# Altium schematic sheet 780-00055, rev1, Pg3, SCH, NRES Temp Meas, 8-Chan RTD .SchDoc
size B; PageSetup: Record=PageOptions|CenterHorizontal=True|CenterVertical=True|PrintScale=1.09|XCorrection=1.00|YCorrection=1.00|PrintKind=0|BorderSize=5000000|LeftOffset=0|BottomOffset=0|Orientation=2|PaperLength=1000|PaperWidth=1000|Scale=100|PaperSource=7|PrintQuality=-4|MediaType=1|DitherType=10|PaperKind=Ledger|PrintScaleMode=1
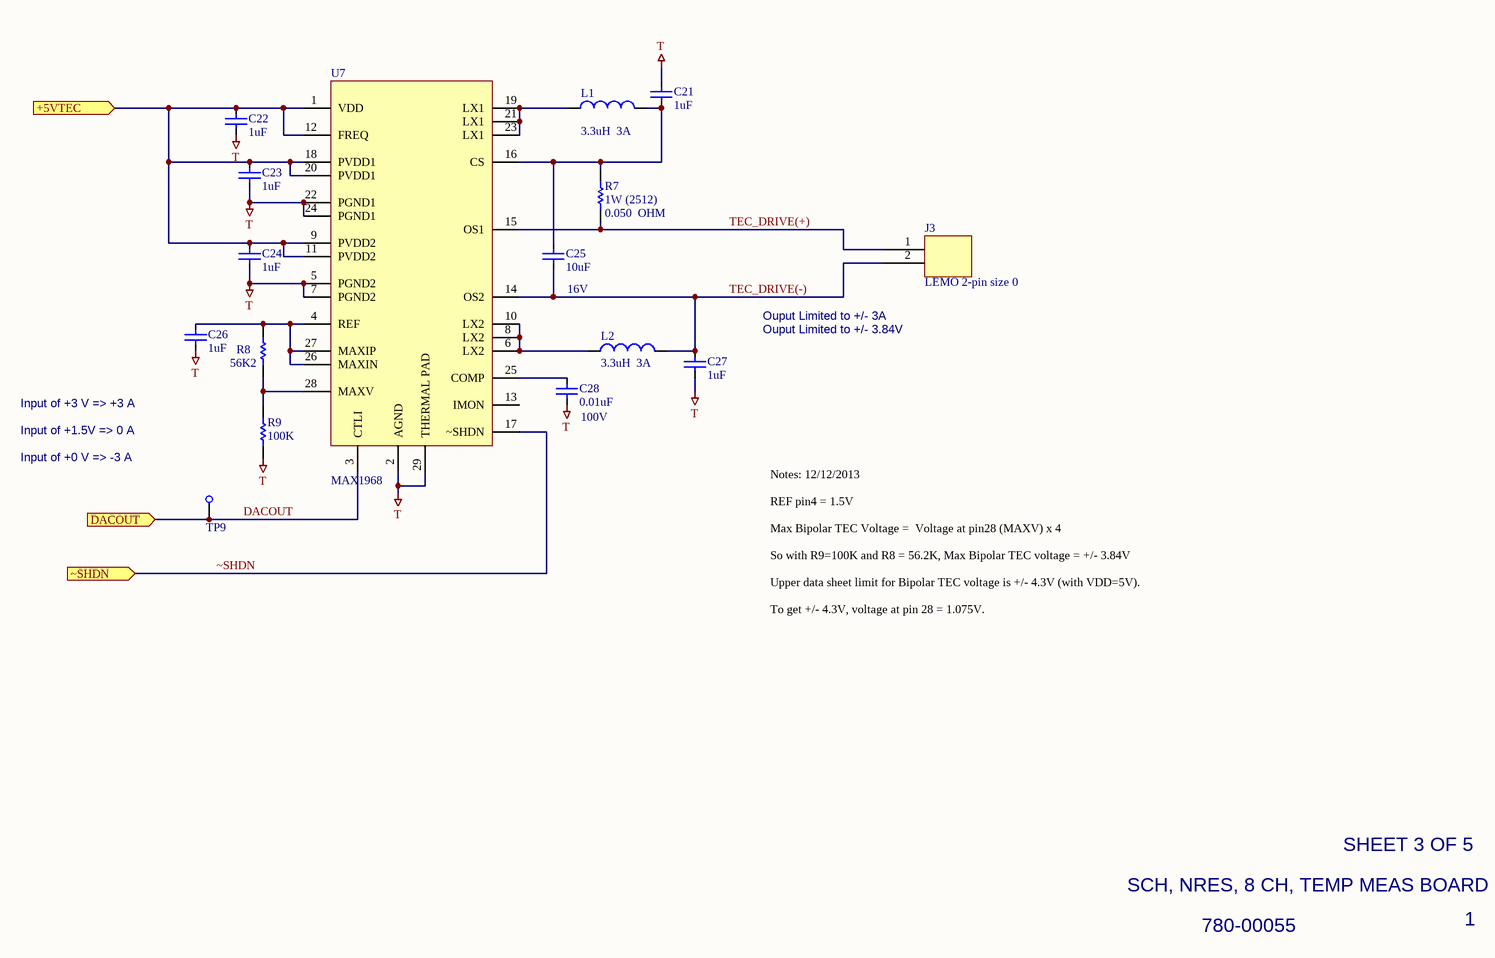
[diagram p0: 780-00055, rev1, Pg3, SCH, NRES Temp Meas, 8-Chan RTD .SchDoc]

## Parts
C21  value 1uF  [SMD_0805]  (hidden comment: Cap SMD)
C22  value 1uF  [SMD_0805]  (hidden comment: Cap SMD)
C23  value 1uF  [SMD_0805]  (hidden comment: Cap SMD)
C24  value 1uF  [SMD_0805]  (hidden comment: Cap SMD)
C25  16V  value 10uF  [SMD_0805]
C26  value 1uF  [SMD_0805]  (hidden comment: Cap SMD)
C27  value 1uF  [SMD_0805]  (hidden comment: Cap SMD)
C28  100V  value 0.01uF  [SMD_0805]
J3  LEMO 2-pin size 0  [LEMO Size 0, 2-pin PCB]
L1  value 3.3uH  3A  [SMT Inductor 7 x 7mm]  (hidden comment: 513-1481-2-ND)
L2  value 3.3uH  3A  [SMT Inductor 7 x 7mm]  (hidden comment: 513-1481-2-ND)
R7  1W (2512)  value 0.050  OHM  [6332[2512]]
R8  value 56K2  [SMD_0805]  (hidden comment: Res 0805)
R9  value 100K  [SMD_0805]  (hidden comment: Res 0805)
TP9  Test point  [PAD_80D_052H]  (value not drawn)
U7  MAX1968  [TSSOP28 Exposed Pad]

## Ports
+5VTEC (in), DACOUT (in), ~SHDN (in)

## Nets
T: C21.2 C22.1 C23.1 C24.1 C26.1 C27.1 C28.1 R9.1 U7.2(AGND) U7.5(PGND2) U7.7(PGND2) U7.22(PGND1) U7.24(PGND1) U7.29(THERMAL_PAD)
+5VTEC: C22.2 C23.2 C24.2 U7.1(VDD) U7.9(PVDD2) U7.11(PVDD2) U7.12(FREQ) U7.18(PVDD1) U7.20(PVDD1) ; port +5VTEC
DACOUT: TP9.1(TP) U7.3(CTLI) ; port DACOUT
TEC_DRIVE(+): J3.1(S29) R7.1 U7.15(OS1)
TEC_DRIVE(-): C25.1 C27.2 J3.2(S30) L2.2 U7.14(OS2)
~SHDN: U7.17(~SHDN) ; port ~SHDN
NetC21_1: C21.1 C25.2 L1.2 R7.2 U7.16(CS)
NetC26_2: C26.2 R8.2 U7.4(REF) U7.26(MAXIN) U7.27(MAXIP)
NetC28_2: C28.2 U7.25(COMP)
NetL1_1: L1.1 U7.19(LX1) U7.21(LX1) U7.23(LX1)
NetL2_1: L2.1 U7.6(LX2) U7.8(LX2) U7.10(LX2)
NetR8_1: R8.1 R9.2 U7.28(MAXV)

Not connected (* = marked no-connect by the designer): U7 13(IMON)

## Notes on the sheet
- Ouput Limited to +/- 3A
- Ouput Limited to +/- 3.84V
- Input of +3 V => +3 A
- Input of +1.5V => 0 A
- Input of +0 V => -3 A
- Notes: 12/12/2013
  REF pin4 = 1.5V
  Max Bipolar TEC Voltage =  Voltage at pin28 (MAXV) x 4
  So with R9=100K and R8 = 56.2K, Max Bipolar TEC voltage = +/- 3.84V
  Upper data sheet limit for Bipolar TEC voltage is +/- 4.3V (with VDD=5V).
  To get +/- 4.3V, voltage at pin 28 = 1.075V.
- SCH, NRES, 8 CH, TEMP MEAS BOARD
- SHEET 3 OF 5
- 780-00055
- 1

## Library data of the parts
C21-C24 C26 C27 = Cap SMD: Capacitor; LCO p/n: 120-00006
C25 = Cap SMD: Capacitor; LCO p/n: 120-00007
C28 = Cap SMD: Capacitor; Manufacturer: Johanson; Manuf p/n: 101X15W103MV4E; Vendor: Digi-Key; Vendor p/n: 709-1325-1-ND; LCO p/n: 120-00050
J3 = LEMO Size 0, 2 pin, PCB: LCO p/n: 125-00371
L1 L2 = Inductor SMD 7 x 7mm: Inductor; Manufacturer: Coiltronics; Manuf p/n: SD7030-3R3-R; Vendor: Digi-Key; Vendor Mult.: 1; LCO p/n: 155-00007; Vendor p/n: 513-1481-2-ND; COST: 1.03
R7 = Res SMD: Manufacturer: Panasonic; Manuf p/n: ERJ-L1WKF50MU; Vendor: DIGIKEY; Vendor p/n: P50MCT-ND; Vendor Mult.: 1; LCO p/n: 180-00014; COST: 1.07
R8 = Res SMD: Resistor 0805; Manufacturer: Vishay/Dale; Manuf p/n: CRCW080556K2FKEA; Vendor: DIGIKEY; Vendor p/n: 541-56K2CCT-ND; Vendor Mult.: 10; LCO p/n: 181-05622; COST: 0.09
R9 = Res SMD: Resistor 0805; Manufacturer: Vishay/Dale; Manuf p/n: CRCW0805100KFKEA; Vendor: DIGIKEY; Vendor p/n: 541-100KCCT-ND; Vendor Mult.: 10; LCO p/n: 181-01003; COST: 0.09
TP9 = Test point: Manufacturer: Keystone; Manuf p/n: 1249; Vendor: Bisco Ind.; LCO p/n: 125-00013; Vendor p/n: 1249; COST: 0.18; VALUE: Test point
U7 = MAX1968: TEC Driver +/- 3A; Manufacturer: Maxim; Manuf p/n: MAX1968EUI+; LCO p/n: 150-00096; Vendor: digikey; Vendor p/n: MAX1968EUI+-ND; VALUE: MAX1968